# EAGLE board BMS_Slave (EAGLE 7.2.0)
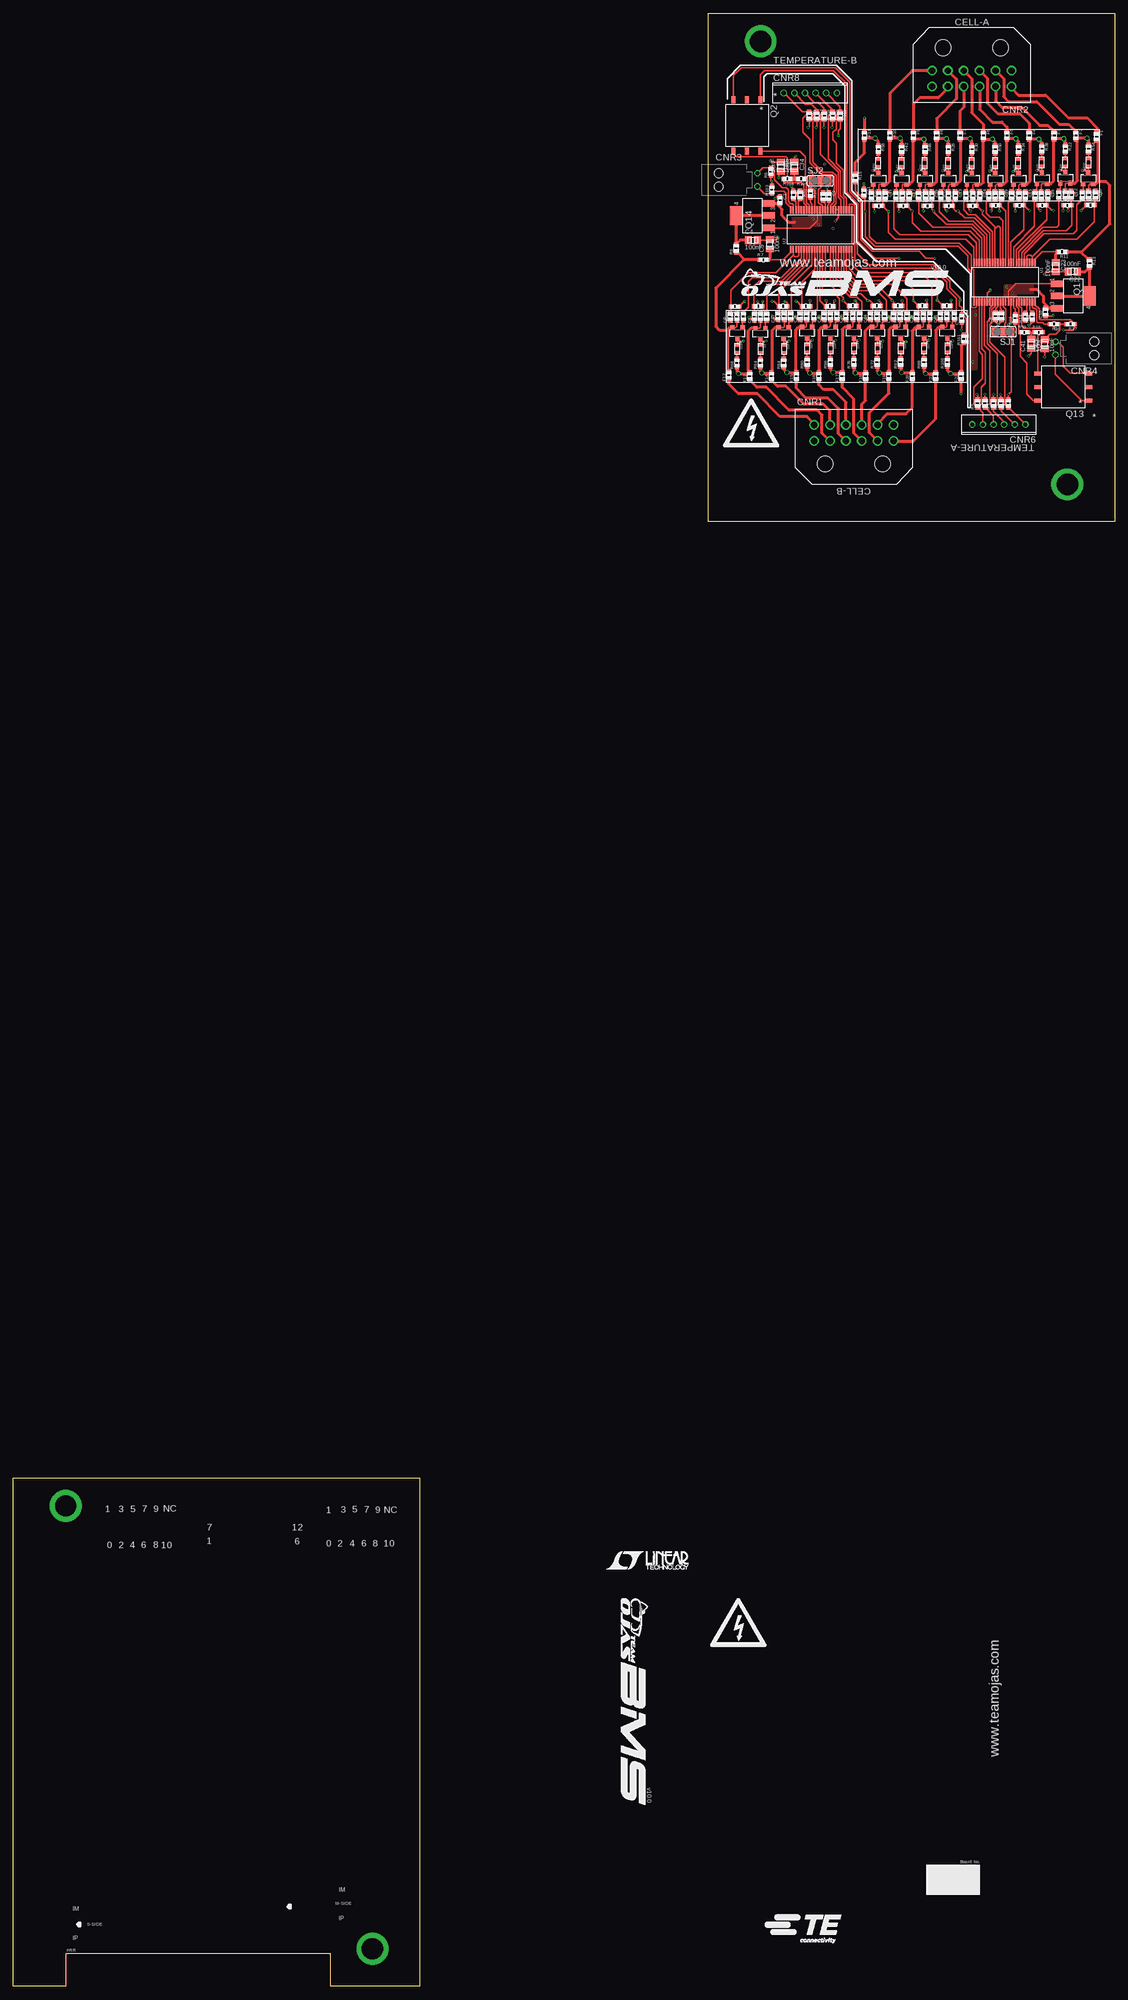
[diagram p5: board, top side]
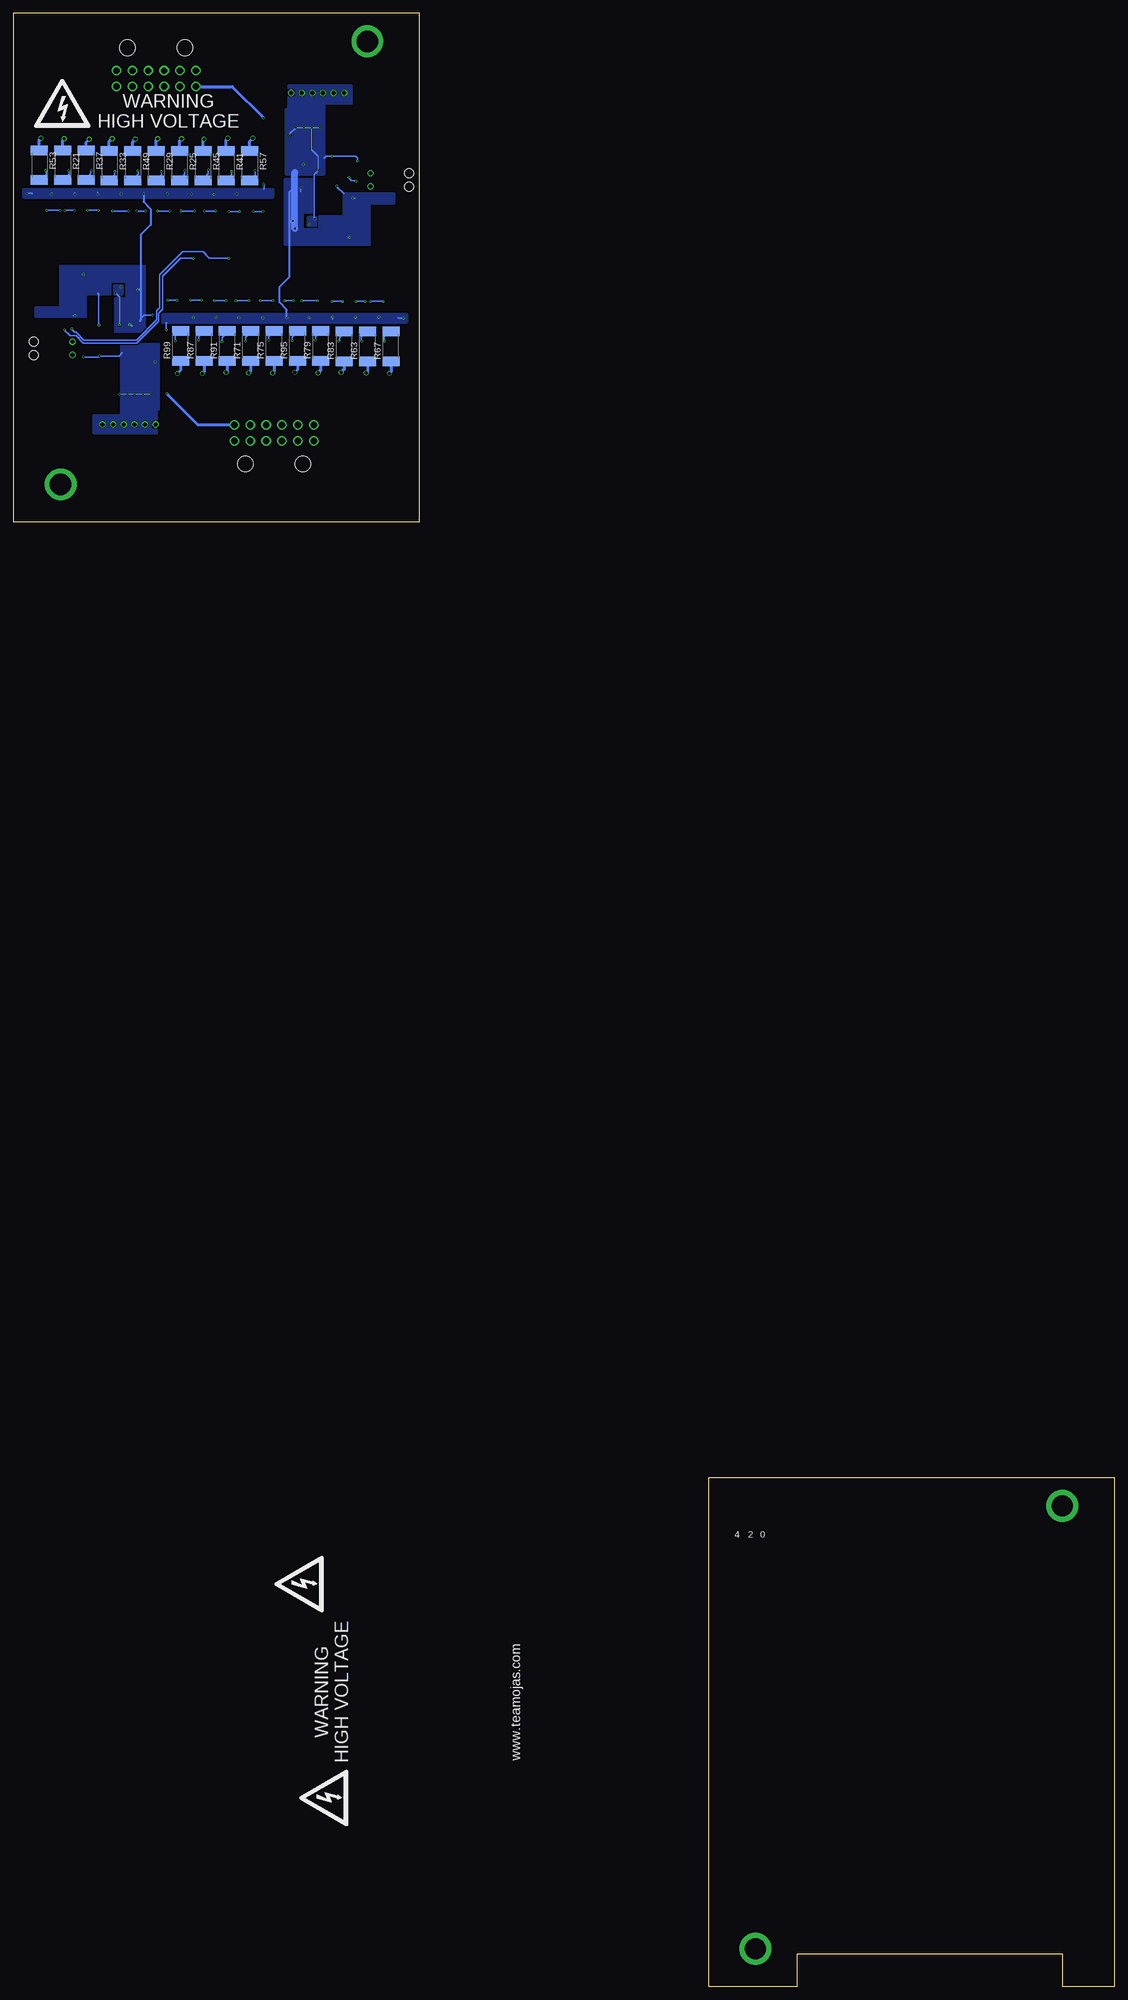
[diagram p6: board, bottom side, seen from below]

Size 207.31 x 371.29 mm. Coordinates in mm from the lower left corner, seen from the top.
Outline: 130.81,371.29 207.31,371.29 207.31,275.59 130.81,275.59 130.81,371.29
Outline: 0,95.7 76.5,95.7 76.5,0 59.7,0 59.7,6.1 9.9,6.1 9.9,0 0,0 0,95.7
Copper layers (1*16): Top 0.035mm / dielectric 1.5mm / Bottom 0.035mm
Design rules "Carnot_syrma": minimum track width 0.1mm, minimum drill 0.2mm, track to track 0.12mm, track to pad 0.12mm, pad to pad 0.12mm, via to via 0.35mm, smd to smd 0.23mm, copper to edge 0.25mm, drill to drill 0.2mm, minimum pad ring 6mil, minimum via ring 4mil, stop-mask expansion 0.05mm, vias tented up to drill 0mil, thermal gap 10mil
tRestrict: 18 lines
bRestrict: 24 lines

## Footprints (pad centres in the part's own frame; a part is rotated, then mirrored left to right if it is on the bottom)
0603 = smd 0.8 x 0.8: P$1 -0.76,0; P$2 0.76,0
0805 = smd 1.3 x 1.5: P$1 -0.85,0; P$2 0.85,0
0430451200 = drill 1.2: 1 7.5,-1.5; 2 4.5,-1.5; 3 1.5,-1.5; 4 -1.5,-1.5; 5 -4.5,-1.5; 6 -7.5,-1.5; 7 7.5,1.5; 8 4.5,1.5; 9 1.5,1.5; 10 -1.5,1.5; 11 -4.5,1.5; 12 -7.5,1.5 | hole 3: -5.4,-5.8; 5.4,-5.8
105313-2202 = drill 0.8 pad 1.2: 1 -1.18,4.98; 2 1.32,4.98 | hole 1.7: -1.18,-2.3; 1.32,-2.3
0532530670 = drill 0.8: 1 -5,0; 2 -3,0; 3 -1,0; 4 1,0; 5 3,0; 6 5,0
LED0603 = smd 0.6 x 0.8: P$1 -0.725,0; P$2 0.725,0
SOT223 = smd 1.219 x 2.235: 1 -2.311,-3.099; 2 0,-3.099; 3 2.311,-3.099 | smd 3.6 x 2.2: 4 0,3.099
HM2101NL = smd 1.3 x 0.76: 1 -4.82,2.54; 2 -4.82,0; 3 -4.82,-2.54; 4 4.82,-2.54; 5 4.82,0; 6 4.82,2.54
SOT23-3 = smd 0.8 x 0.9: 1 -0.95,-1; 2 0.95,-1; 3 0,1.1
2512 = smd 1.8 x 3.2: 1 -2.8,0; 2 2.8,0
SJ_2 = smd 1.168 x 1.6: 1 -1.524,0; 2 0,0; 3 1.524,0
48-LEAD_SSOP = smd 1.4 x 0.3: 1 -3.7,5.8; 2 -3.7,5.3; 3 -3.7,4.8; 4 -3.7,4.3; 5 -3.7,3.8; 6 -3.7,3.3; 7 -3.7,2.8; 8 -3.7,2.3; 9 -3.7,1.8; 10 -3.7,1.3; 11 -3.7,0.8; 12 -3.7,0.3; 13 -3.7,-0.2; 14 -3.7,-0.7; 15 -3.7,-1.2; 16 -3.7,-1.7; 17 -3.7,-2.2; 18 -3.7,-2.7; 19 -3.7,-3.2; 20 -3.7,-3.7; 21 -3.7,-4.2; 22 -3.7,-4.7; 23 -3.7,-5.2; 24 -3.7,-5.7; 25 3.7,-5.7; 26 3.7,-5.2; 27 3.7,-4.7; 28 3.7,-4.2; 29 3.7,-3.7; 30 3.7,-3.2; 31 3.7,-2.7; 32 3.7,-2.2; 33 3.7,-1.7; 34 3.7,-1.2; 35 3.7,-0.7; 36 3.7,-0.2; 37 3.7,0.3; 38 3.7,0.8; 39 3.7,1.3; 40 3.7,1.8; 41 3.7,2.3; 42 3.7,2.8; 43 3.7,3.3; 44 3.7,3.8; 45 3.7,4.3; 46 3.7,4.8; 47 3.7,5.3; 48 3.7,5.8

## Placement (x,y rotation side)
C1  1uF  [0603]  153.52,336.8 270 top
C2  1uF  [0603]  152.42,336.8 270 top
C3  1uF  [0603]  144.32,336.1 270 top
C4  100nF  [0805]  139.21,328.6 0 top
C5  100nF  [0805]  142.42,327.8 90 top
C6  10nF  [0603]  139.52,314.2 90 top
C7  10nF  [0603]  134.92,314.22 90 top
C8  1uF  [0603]  184.91,314.29 90 top
C9  1uF  [0603]  186.01,314.29 90 top
C10  1uF  [0603]  194.31,315.09 90 top
C11  10nF  [0603]  160.09,337.52 270 top
C12  10nF  [0603]  199.11,337.09 270 top
C13  10nF  [0603]  177.31,336.99 270 top
C14  10nF  [0603]  181.91,336.99 270 top
C15  10nF  [0603]  190.51,336.99 270 top
C16  10nF  [0603]  194.71,336.99 270 top
C17  10nF  [0603]  168.61,336.99 270 top
C18  10nF  [0603]  172.91,336.99 270 top
C19  10nF  [0603]  186.01,336.99 270 top
C20  10nF  [0603]  203.71,337.07 270 top
C21  10nF  [0603]  164.11,336.99 270 top
C22  100nF  [0805]  199.42,322.69 180 top
C23  100nF  [0805]  196.21,323.49 270 top
C24  10nF  [0603]  161.32,314.3 90 top
C25  10nF  [0603]  156.72,314.3 90 top
C26  10nF  [0603]  148.12,314.3 90 top
C27  10nF  [0603]  143.92,314.3 90 top
C28  10nF  [0603]  170.02,314.3 90 top
C29  10nF  [0603]  165.72,314.3 90 top
C30  10nF  [0603]  152.62,314.3 90 top
C31  10nF  [0603]  174.52,314.3 90 top
C32  10nF  [0603]  178.54,313.87 90 top
C33  10nF  [0805]  144.47,342.42 270 top
C34  10nF  [0805]  147.01,342.39 270 top
C35  10nF  [0603]  140.22,316.1 180 top
C36  10nF  [0603]  135.85,316.06 180 top
C37  10nF  [0603]  144.92,316.1 180 top
C38  10nF  [0603]  149.22,316.1 180 top
C39  10nF  [0603]  153.72,316.1 180 top
C40  10nF  [0805]  194.16,309.05 90 top
C41  10nF  [0805]  191.61,309.09 90 top
C42  10nF  [0603]  158.02,316.2 180 top
C43  10nF  [0603]  198.41,335.19 0 top
C44  10nF  [0603]  202.78,335.23 0 top
C45  10nF  [0603]  193.71,335.19 0 top
C46  10nF  [0603]  189.41,335.19 0 top
C47  10nF  [0603]  184.91,335.19 0 top
C48  10nF  [0603]  180.61,335.09 0 top
C49  10nF  [0603]  176.11,335.09 0 top
C50  10nF  [0603]  172.11,335.09 0 top
C51  10nF  [0603]  167.51,335.09 0 top
C52  10nF  [0603]  162.91,335.09 0 top
C53  10nF  [0603]  162.52,316.2 180 top
C54  10nF  [0603]  166.52,316.2 180 top
C55  10nF  [0603]  171.12,316.2 180 top
C56  10nF  [0603]  175.72,316.2 180 top
CNR1  [0430451200]  158.22,292.3 0 top
CNR2  [0430451200]  180.41,358.99 180 top
CNR3  COMM-CONNECTOR  [105313-2202]  135.08,340 270 top
CNR4  COMM-CONNECTOR  [105313-2202]  201.14,308.16 90 top
CNR6  MICRO-LATCH  [0532530670]  185.51,293.89 180 top
CNR8  MICRO-LATCH  [0532530670]  150.02,356.3 0 top
D1  LED6X3MM'  [LED0603]  140.62,308.1 270 top
D2  LED6X3MM'  [LED0603]  198.01,343.19 90 top
D3  LED6X3MM'  [LED0603]  176.01,343.09 90 top
D4  LED6X3MM'  [LED0603]  180.41,343.09 90 top
D5  LED6X3MM'  [LED0603]  189.21,343.09 90 top
D6  LED6X3MM'  [LED0603]  193.61,343.19 90 top
D7  LED6X3MM'  [LED0603]  167.21,343.09 90 top
D8  LED6X3MM'  [LED0603]  171.61,343.09 90 top
D9  LED6X3MM'  [LED0603]  184.81,343.09 90 top
D10  LED6X3MM'  [LED0603]  202.41,343.19 90 top
D11  LED6X3MM'  [LED0603]  162.81,343.09 90 top
D12  LED6X3MM'  [LED0603]  136.22,308.1 270 top
D13  LED6X3MM'  [LED0603]  162.62,308.2 270 top
D14  LED6X3MM'  [LED0603]  158.22,308.2 270 top
D15  LED6X3MM'  [LED0603]  149.42,308.2 270 top
D16  LED6X3MM'  [LED0603]  145.02,308.1 270 top
D17  LED6X3MM'  [LED0603]  171.42,308.2 270 top
D18  LED6X3MM'  [LED0603]  167.02,308.2 270 top
D19  LED6X3MM'  [LED0603]  153.82,308.2 270 top
D20  LED6X3MM'  [LED0603]  175.82,308.2 270 top
F1  F0603  [0603]  203.91,348.09 270 top
F2  F0603  [0603]  200.01,348.29 270 top
F3  F0603  [0603]  195.91,348.29 270 top
F4  F0603  [0603]  191.21,348.29 270 top
F5  F0603  [0603]  187.01,348.29 270 top
F6  F0603  [0603]  182.61,348.29 270 top
F7  F0603  [0603]  178.21,348.29 270 top
F8  F0603  [0603]  173.81,348.29 270 top
F9  F0603  [0603]  169.41,348.29 270 top
F10  F0603  [0603]  165.01,348.29 270 top
F11  F0603  [0603]  160.21,348.29 270 top
F12  F0603  [0603]  134.72,303.2 90 top
F13  F0603  [0603]  138.62,303 90 top
F14  F0603  [0603]  142.72,303 90 top
F15  F0603  [0603]  147.42,303 90 top
F16  F0603  [0603]  151.62,303 90 top
F17  F0603  [0603]  156.02,303 90 top
F18  F0603  [0603]  160.42,303 90 top
F19  F0603  [0603]  164.82,303 90 top
F20  F0603  [0603]  169.22,303 90 top
F21  F0603  [0603]  173.62,303 90 top
F22  F0603  [0603]  178.42,303 90 top
Q1  CZT5551  [SOT223]  199.51,318.09 270 top
Q2  HM2101NL  [HM2101NL]  138.11,350.19 270 top
Q3  BSS308PE  [SOT23-3]  198.01,340.29 0 top
Q4  BSS308PE  [SOT23-3]  176.01,340.09 0 top
Q5  BSS308PE  [SOT23-3]  180.41,340.09 0 top
Q6  BSS308PE  [SOT23-3]  189.21,340.09 0 top
Q7  BSS308PE  [SOT23-3]  193.61,340.19 0 top
Q8  BSS308PE  [SOT23-3]  167.21,340.09 0 top
Q9  BSS308PE  [SOT23-3]  171.61,340.09 0 top
Q10  BSS308PE  [SOT23-3]  184.81,340.09 0 top
Q11  BSS308PE  [SOT23-3]  202.31,340.19 0 top
Q12  BSS308PE  [SOT23-3]  162.81,340.09 0 top
Q13  HM2101NL  [HM2101NL]  197.64,300.94 180 top
Q14  CZT5551  [SOT223]  139.12,333.2 90 top
Q15  BSS308PE  [SOT23-3]  140.62,311 180 top
Q16  BSS308PE  [SOT23-3]  136.32,311.1 180 top
Q17  BSS308PE  [SOT23-3]  162.62,311.2 180 top
Q18  BSS308PE  [SOT23-3]  158.22,311.2 180 top
Q19  BSS308PE  [SOT23-3]  149.42,311.2 180 top
Q20  BSS308PE  [SOT23-3]  145.02,311.1 180 top
Q21  BSS308PE  [SOT23-3]  171.42,311.2 180 top
Q22  BSS308PE  [SOT23-3]  167.02,311.2 180 top
Q23  BSS308PE  [SOT23-3]  153.82,311.2 180 top
Q24  BSS308PE  [SOT23-3]  175.82,311.2 180 top
R1  100R  [0603]  187.31,297.89 90 top
R2  100R  [0603]  185.91,297.89 90 top
R3  100R  [0603]  184.51,297.89 90 top
R4  100R  [0603]  182.91,297.89 90 top
R5  100R  [0603]  181.51,297.89 90 top
R6  51R  [0603]  142.6,341.48 90 top
R7  100R  [0603]  141.22,324.9 0 top
R8  1.2k  [0603]  146.82,337.1 270 top
R9  100R  [0603]  136.07,327.05 90 top
R10  51R  [0603]  195.91,312.79 180 top
R11  100R  [0603]  197.41,326.39 180 top
R12  1.2k  [0603]  191.81,314.19 90 top
R13  100R  [0603]  202.56,324.24 270 top
R14  806R  [0603]  190.51,314.19 90 top
R15  100R  [0603]  158.51,340.29 270 top
R16  1M  [0603]  188.61,313.89 90 top
R17  51R  [0603]  199.01,312.79 180 top
R18  51R  [0603]  193.01,311.29 0 top
R19  100R  [0603]  198.01,337.09 270 top
R20  3.3k  [0603]  196.81,337.09 270 top
R21  33R  [2512]  198.01,342.69 270 bottom
R22  475R  [0603]  198.01,345.79 270 top
R23  100R  [0603]  176.01,336.99 270 top
R24  3.3k  [0603]  174.61,336.99 270 top
R25  33R  [2512]  176.01,342.59 270 bottom
R26  475R  [0603]  176.01,345.69 270 top
R27  100R  [0603]  180.61,336.99 270 top
R28  3.3k  [0603]  179.31,336.99 270 top
R29  33R  [2512]  180.41,342.59 270 bottom
R30  475R  [0603]  180.41,345.69 270 top
R31  100R  [0603]  189.31,336.99 270 top
R32  3.3k  [0603]  187.91,336.99 270 top
R33  33R  [2512]  189.21,342.59 270 bottom
R34  475R  [0603]  189.21,345.69 270 top
R35  100R  [0603]  193.51,336.99 270 top
R36  3.3k  [0603]  192.31,336.99 270 top
R37  33R  [2512]  193.61,342.69 270 bottom
R38  475R  [0603]  193.61,345.79 270 top
R39  100R  [0603]  167.31,336.99 270 top
R40  3.3k  [0603]  166.11,336.99 270 top
R41  33R  [2512]  167.21,342.59 270 bottom
R42  475R  [0603]  167.21,345.69 270 top
R43  100R  [0603]  171.71,336.99 270 top
R44  3.3k  [0603]  170.41,336.99 270 top
R45  33R  [2512]  171.61,342.59 270 bottom
R46  475R  [0603]  171.61,345.69 270 top
R47  100R  [0603]  184.81,336.99 270 top
R48  3.3k  [0603]  183.61,336.99 270 top
R49  33R  [2512]  184.81,342.59 270 bottom
R50  475R  [0603]  184.81,345.69 270 top
R51  100R  [0603]  202.41,337.09 270 top
R52  3.3k  [0603]  201.22,337.05 270 top
R53  33R  [2512]  202.41,342.69 270 bottom
R54  475R  [0603]  202.41,345.79 270 top
R55  100R  [0603]  162.91,336.99 270 top
R56  3.3k  [0603]  161.51,336.99 270 top
R57  33R  [2512]  162.81,342.59 270 bottom
R58  475R  [0603]  162.81,345.69 270 top
R59  51R  [0603]  190.31,311.29 0 top
R60  806R  [0603]  148.12,337.1 270 top
R61  100R  [0603]  140.62,314.2 90 top
R62  3.3k  [0603]  141.82,314.2 90 top
R63  33R  [2512]  140.62,308.6 90 bottom
R64  475R  [0603]  140.62,305.5 90 top
R65  100R  [0603]  136.22,314.2 90 top
R66  3.3k  [0603]  137.41,314.24 90 top
R67  33R  [2512]  136.22,308.6 90 bottom
R68  475R  [0603]  136.22,305.5 90 top
R69  100R  [0603]  162.62,314.3 90 top
R70  3.3k  [0603]  164.02,314.3 90 top
R71  33R  [2512]  162.62,308.7 90 bottom
R72  475R  [0603]  162.62,305.6 90 top
R73  100R  [0603]  158.02,314.3 90 top
R74  3.3k  [0603]  159.32,314.3 90 top
R75  33R  [2512]  158.22,308.7 90 bottom
R76  475R  [0603]  158.22,305.6 90 top
R77  100R  [0603]  149.32,314.3 90 top
R78  3.3k  [0603]  150.72,314.3 90 top
R79  33R  [2512]  149.42,308.7 90 bottom
R80  475R  [0603]  149.42,305.6 90 top
R81  100R  [0603]  145.12,314.3 90 top
R82  3.3k  [0603]  146.32,314.3 90 top
R83  33R  [2512]  145.02,308.6 90 bottom
R84  475R  [0603]  145.02,305.5 90 top
R85  100R  [0603]  171.32,314.3 90 top
R86  3.3k  [0603]  172.52,314.3 90 top
R87  33R  [2512]  171.42,308.7 90 bottom
R88  475R  [0603]  171.42,305.6 90 top
R89  100R  [0603]  166.92,314.3 90 top
R90  3.3k  [0603]  168.22,314.3 90 top
R91  33R  [2512]  167.02,308.7 90 bottom
R92  475R  [0603]  167.02,305.6 90 top
R93  100R  [0603]  153.82,314.3 90 top
R94  3.3k  [0603]  155.02,314.3 90 top
R95  33R  [2512]  153.82,308.7 90 bottom
R96  475R  [0603]  153.82,305.6 90 top
R97  100R  [0603]  175.72,314.3 90 top
R98  3.3k  [0603]  177.12,314.3 90 top
R99  33R  [2512]  175.82,308.7 90 bottom
R100  475R  [0603]  175.82,305.6 90 top
R101  100R  [0603]  178.92,310 90 top
R102  1M  [0603]  150.02,337.4 270 top
R103  51R  [0603]  142.8,338.08 90 top
R104  51R  [0603]  145.71,340.09 180 top
R105  51R  [0603]  148.31,340.09 180 top
R106  100R  [0603]  149.82,352 270 top
R107  100R  [0603]  151.22,352 270 top
R108  100R  [0603]  152.62,352 270 top
R109  100R  [0603]  154.22,352 270 top
R110  100R  [0603]  155.62,352 270 top
SJ1  [SJ_2]  186.32,311.37 180 top
SJ2  [SJ_2]  151.91,339.79 0 top
U1  LTC6804  [48-LEAD_SSOP]  186.51,320.69 270 top
U2  LTC6804  [48-LEAD_SSOP]  152.12,330.6 90 top

## Tracks (layer width: path | path; a pad name or v marks a point on that pad's centre or on a via)
5_VREG-A  (via drill 0.25)
  Top 0.254: 188.31,317.02 U1.40 188.29,316.97 188.29,315.91 188.61,315.59 R16.P$2 | R5.P$2 181.51,299.49 v181.41,299.59 | R1.P$2 v187.31,299.59 187.85,300.13 SJ1.1 187.85,312.15 v187.31,312.69 | R4.P$2 v182.91,299.59 | R3.P$2 v184.51,299.59 | R2.P$2 185.91,299.49 v185.81,299.59
  Top 0.61: Q1.3 195.04,315.78 | 191.51,319.29 192.71,319.29 193.91,318.09 193.91,316.91 195.04,315.78 | 195.04,315.78 194.38,315.78 C10.P$2
  Bottom 0.254: v181.41,299.59 v182.91,299.59 v184.51,299.59 v185.81,299.59 v187.31,299.59 | v187.31,312.69 187.31,317.89 v188.11,318.69
  other vias: 187.01,319.79
  pour Top: 186.51,317.19 188.81,317.19 188.81,318.49 192.01,318.49 192.01,320.09 186.51,320.09
  pour Bottom: 186.71,318.29 188.41,318.29 188.41,320.09 186.71,320.09
5_VREG-B  (via drill 0.25)
  Top 0.254: 150.32,334.27 U2.40 150.34,334.32 150.34,335.38 150.02,335.7 R102.P$2 | R106.P$2 149.82,350 v149.61,349.79 | R110.P$2 155.71,351.15 155.71,349.59 155.31,349.19 v155.31,348.29 | R107.P$2 151.22,349.9 v151.11,349.79 | R108.P$2 v152.62,349.8 v152.61,349.79 | R109.P$2 154.22,349.9 v154.11,349.79 | v149.91,341.69 150.48,341.12 150.48,339.88 SJ2.1
  Top 0.61: Q14.3 143.59,335.51 | 147.12,332 145.92,332 144.72,333.2 144.72,334.38 143.59,335.51 | 143.59,335.51 144.15,335.51 C3.P$2
  Bottom 0.254: v149.61,349.79 v151.11,349.79 | v151.11,349.79 v152.61,349.79 v154.11,349.79 155.31,348.59 v155.31,348.29 | v151.11,349.79 151.11,345.59 149.91,344.39 v149.91,341.69 150.71,340.89 150.71,332.79 v150.52,332.6
  other vias: 151.62,331.6
  pour Top: 152.12,334.1 149.82,334.1 149.82,332.8 146.62,332.8 146.62,331.2 152.12,331.2
  pour Bottom: 151.92,333 150.22,333 150.22,331.2 151.92,331.2
AFT0  (via drill 0.6)
  Top 0.61: R58.P$1 162.81,347.19 v162.21,347.79 160.47,347.79 F11.P$2 160.21,344.99 158.51,343.29 R15.P$1
  Bottom 0.61: R57.1 162.81,347.19 v162.21,347.79
AFT1  (via drill 0.6)
  Top 0.254: R55.P$1 162.91,338.89 163.11,339.09 Q12.2
  Top 0.61: Q12.2 164.41,339.09 165.01,339.69 F10.P$2 165.27,347.79 v166.91,347.79 167.21,347.49 R42.P$1
  Bottom 0.61: R41.1 167.21,347.49 v166.91,347.79
AFT2  (via drill 0.6)
  Top 0.254: R39.P$1 167.31,338.89 167.51,339.09 Q8.2
  Top 0.61: Q8.2 168.71,339.09 169.41,339.79 F9.P$2 169.47,347.59 v171.41,347.59 171.61,347.39 R46.P$1
  Bottom 0.61: R45.1 171.61,347.39 v171.41,347.59
AFT3  (via drill 0.6)
  Top 0.254: R43.P$1 171.71,338.89 171.91,339.09 Q9.2
  Top 0.61: Q9.2 173.31,339.09 173.81,339.59 F8.P$2 173.97,347.69 v175.61,347.69 176.01,347.29 R26.P$1
  Bottom 0.61: R25.1 176.01,347.29 v175.61,347.69
AFT4  (via drill 0.6)
  Top 0.254: R23.P$1 176.01,338.79 176.31,339.09 Q4.2
  Top 0.61: Q4.2 177.61,339.09 178.31,339.79 178.31,347.43 F7.P$2 178.37,347.69 v180.11,347.69 180.41,347.39 R30.P$1
  Bottom 0.61: R29.1 180.41,347.39 v180.11,347.69
AFT5  (via drill 0.6)
  Top 0.254: R27.P$1 180.61,338.89 180.81,339.09 Q5.2
  Top 0.61: Q5.2 182.21,339.09 182.61,339.49 F6.P$2 182.65,347.49 182.75,347.59 v184.31,347.59 184.81,347.09 R50.P$1
  Bottom 0.61: R49.1 184.81,347.09 v184.31,347.59
AFT6  (via drill 0.6)
  Top 0.254: R47.P$1 184.81,338.79 185.11,339.09 Q10.2
  Top 0.61: Q10.2 186.41,339.09 187.01,339.69 F5.P$2 187.17,347.69 v188.71,347.69 189.21,347.19 R34.P$1
  Bottom 0.61: R33.1 189.21,347.19 v188.71,347.69
AFT7  (via drill 0.6)
  Top 0.254: R31.P$1 189.31,338.89 189.51,339.09 Q6.2
  Top 0.61: Q6.2 190.81,339.09 191.41,339.69 191.41,347.33 F4.P$2 191.27,347.59 v193.01,347.59 193.61,346.99 R38.P$1
  Bottom 0.61: R37.1 193.61,346.99 v193.01,347.59
AFT8  (via drill 0.6)
  Top 0.254: R35.P$1 193.51,338.99 193.71,339.19 Q7.2
  Top 0.61: Q7.2 195.31,339.19 195.81,339.69 195.81,347.43 F3.P$2 196.07,347.69 v197.71,347.69 198.01,347.39 R22.P$1
  Bottom 0.61: R21.1 198.01,347.39 v197.71,347.69
AFT9  (via drill 0.6)
  Top 0.254: R19.P$1 198.01,339.09 198.21,339.29 Q3.2
  Top 0.61: Q3.2 199.81,339.29 200.31,339.79 200.31,347.23 F2.P$2 200.27,347.79 v202.11,347.79 202.41,347.49 R54.P$1
  Bottom 0.61: R53.1 202.41,347.49 v202.11,347.79
AFT10-A
  Top 0.254: R51.P$1 202.41,338.89 202.71,339.19 Q11.2
  Top 0.61: Q11.2 203.81,339.19 204.21,339.59 | 204.21,339.59 204.21,347.03 F1.P$2 | R11.P$1 201.01,326.39 | 201.01,326.39 201.11,326.39 206.41,331.69 206.41,338.89 205.71,339.59 204.21,339.59 | 201.01,326.39 200.96,326.34 202.31,325 R13.P$1
AFT10-B  (via drill 0.6)
  Top 0.61: R100.P$1 175.82,304.1 v176.42,303.5 178.16,303.5 F22.P$2 178.42,308.74 R101.P$1
  Bottom 0.61: R99.1 175.82,304.1 v176.42,303.5
AFT11  (via drill 0.6)
  Top 0.254: R97.P$1 175.72,312.4 175.52,312.2 Q24.2
  Top 0.61: Q24.2 174.22,312.2 173.62,311.6 F21.P$2 173.36,303.5 v171.72,303.5 171.42,303.8 R88.P$1
  Bottom 0.61: R87.1 171.42,303.8 v171.72,303.5
AFT12  (via drill 0.6)
  Top 0.254: R85.P$1 171.32,312.4 171.12,312.2 Q21.2
  Top 0.61: Q21.2 169.92,312.2 169.22,311.5 F20.P$2 169.16,303.7 v167.22,303.7 167.02,303.9 R92.P$1
  Bottom 0.61: R91.1 167.02,303.9 v167.22,303.7
AFT13  (via drill 0.6)
  Top 0.254: R89.P$1 166.92,312.4 166.72,312.2 Q22.2
  Top 0.61: Q22.2 165.32,312.2 164.82,311.7 F19.P$2 164.66,303.6 v163.02,303.6 162.62,304 R72.P$1
  Bottom 0.61: R71.1 162.62,304 v163.02,303.6
AFT14  (via drill 0.6)
  Top 0.254: R69.P$1 162.62,312.5 162.32,312.2 Q17.2
  Top 0.61: Q17.2 161.02,312.2 160.32,311.5 160.32,303.86 F18.P$2 160.26,303.6 v158.52,303.6 158.22,303.9 R76.P$1
  Bottom 0.61: R75.1 158.22,303.9 v158.52,303.6
AFT15  (via drill 0.6)
  Top 0.254: R73.P$1 158.02,312.4 157.82,312.2 Q18.2
  Top 0.61: Q18.2 156.42,312.2 156.02,311.8 F17.P$2 155.98,303.8 155.88,303.7 v154.32,303.7 153.82,304.2 R96.P$1
  Bottom 0.61: R95.1 153.82,304.2 v154.32,303.7
AFT16  (via drill 0.6)
  Top 0.254: R93.P$1 153.82,312.5 153.52,312.2 Q23.2
  Top 0.61: Q23.2 152.22,312.2 151.62,311.6 F16.P$2 151.46,303.6 v149.92,303.6 149.42,304.1 R80.P$1
  Bottom 0.61: R79.1 149.42,304.1 v149.92,303.6
AFT17  (via drill 0.6)
  Top 0.254: R77.P$1 149.32,312.4 149.12,312.2 Q19.2
  Top 0.61: Q19.2 147.82,312.2 147.22,311.6 147.22,303.96 F15.P$2 147.36,303.7 v145.62,303.7 145.02,304.3 R84.P$1
  Bottom 0.61: R83.1 145.02,304.3 v145.62,303.7
AFT18  (via drill 0.6)
  Top 0.254: R81.P$1 145.12,312.3 144.92,312.1 Q20.2
  Top 0.61: Q20.2 143.32,312.1 142.82,311.6 142.82,303.86 F14.P$2 142.56,303.6 v140.92,303.6 140.62,303.9 R64.P$1
  Bottom 0.61: R63.1 140.62,303.9 v140.92,303.6
AFT19  (via drill 0.6)
  Top 0.254: R61.P$1 140.62,312.2 140.42,312 Q15.2
  Top 0.61: Q15.2 138.82,312 138.32,311.5 138.32,304.06 F13.P$2 138.36,303.5 v136.52,303.5 136.22,303.8 R68.P$1
  Bottom 0.61: R67.1 136.22,303.8 v136.52,303.5
AFT20
  Top 0.254: R65.P$1 136.22,312.4 135.92,312.1 Q16.2
  Top 0.61: Q16.2 134.82,312.1 134.42,311.7 | 134.42,311.7 134.42,304.26 F12.P$2 | R7.P$1 137.62,324.9 | 137.62,324.9 137.52,324.9 132.22,319.6 132.22,312.4 132.92,311.7 134.42,311.7 | 137.62,324.9 137.67,324.95 136.32,326.29 R9.P$1
CELL1
  Top 0.61: CNR2.1 169.21,360.49 165.01,356.29 F10.P$1
CELL2
  Top 0.61: CNR2.8 175.91,357.19 174.11,355.39 170.61,355.39 169.41,354.19 F9.P$1
CELL3
  Top 0.61: CNR2.2 177.51,358.89 177.51,355.19 173.81,351.49 F8.P$1
CELL4
  Top 0.61: CNR2.9 178.91,353.59 178.21,352.89 F7.P$1
CELL5
  Top 0.61: CNR2.3 180.41,358.99 180.41,352.59 182.61,350.39 F6.P$1
CELL6
  Top 0.61: CNR2.10 181.91,353.19 184.31,350.79 186.11,350.79 187.01,349.89 F5.P$1
CELL7
  Top 0.61: CNR2.4 183.31,359.09 183.31,354.39 185.31,352.39 189.41,352.39 191.21,350.59 F4.P$1
CELL8
  Top 0.61: CNR2.11 184.91,354.79 186.11,353.59 189.81,353.59 193.21,350.19 194.77,350.19 F3.P$1
CELL9
  Top 0.61: CNR2.5 186.41,358.99 186.41,355.59 187.31,354.69 192.61,354.69 196.91,350.39 198.67,350.39 F2.P$1
CELL10
  Top 0.61: CNR2.12 187.91,357.19 189.21,355.89 194.31,355.89 198.61,351.59 202.11,351.59 203.91,349.79 F1.P$1
CELL11
  Top 0.61: CNR1.1 169.42,290.8 173.62,295 F21.P$1
CELL12
  Top 0.61: CNR1.8 162.72,294.1 164.52,295.9 168.02,295.9 169.22,297.1 F20.P$1
CELL13
  Top 0.61: CNR1.2 161.12,292.4 161.12,296.1 164.82,299.8 F19.P$1
CELL14
  Top 0.61: CNR1.9 159.72,297.7 160.42,298.4 F18.P$1
CELL15
  Top 0.61: CNR1.3 158.22,292.3 158.22,298.7 156.02,300.9 F17.P$1
CELL16
  Top 0.61: CNR1.10 156.72,298.1 154.32,300.5 152.52,300.5 151.62,301.4 F16.P$1
CELL17
  Top 0.61: CNR1.4 155.32,292.2 155.32,296.9 153.32,298.9 149.22,298.9 147.42,300.7 F15.P$1
CELL18
  Top 0.61: CNR1.11 153.72,296.5 152.52,297.7 148.82,297.7 145.42,301.1 143.86,301.1 F14.P$1
CELL19
  Top 0.61: CNR1.5 152.22,292.3 152.22,295.7 151.32,296.6 146.02,296.6 141.72,300.9 139.96,300.9 F13.P$1
CELL20
  Top 0.61: CNR1.12 150.72,294.1 149.42,295.4 144.32,295.4 140.02,299.7 136.52,299.7 134.72,301.5 F12.P$1
CELL-GND-A  (via drill 0.25)
  Top 0.61: v160.21,351.59 F11.P$1
  Bottom 0.61: CNR2.7 166.11,357.49 v160.21,351.59
CELL-GND-B  (via drill 0.25)
  Top 0.61: v178.42,299.7 F22.P$1
  Bottom 0.61: CNR1.7 172.52,293.8 v178.42,299.7
GNDA  (via drill 0.25)
  Top 0.254: C21.P$1 164.75,337.75 v165.21,337.29 | C17.P$1 168.95,337.75 v169.51,337.19 | C18.P$1 173.35,337.75 v173.81,337.29 | C13.P$1 177.85,337.75 v178.31,337.29 | C14.P$1 182.35,337.75 v182.81,337.29 | C19.P$1 186.55,337.75 v187.01,337.29 | C15.P$1 190.85,337.75 v191.41,337.19 | C16.P$1 195.15,337.75 v195.71,337.19 | C12.P$1 199.45,337.85 v200.11,337.19 | C20.P$1 204.26,337.83 v204.71,337.39 | U1.31 U1.30 183.31,318.59 v183.91,319.19 | C11.P$1 160.09,338.87 160.11,338.89 v160.11,339.19 | v194.11,322.19 194.56,322.64 C23.P$2 196.26,322.69 C22.P$2 | C8.P$1 184.91,313.19 v185.41,312.69 | SJ1.3 184.8,312.08 v185.41,312.69 | C9.P$1 186.01,313.29 v185.41,312.69 | C10.P$1 195.65,314.33 v195.71,314.39 | R12.P$1 191.81,313.19 v191.21,312.59 | C41.P$1 191.61,307.29 v191.11,306.79 | C40.P$1 194.16,306.64 v194.11,306.59
  Bottom 0.254: v165.21,337.29 165.21,337.19 | v169.51,337.19 169.51,337.29 | v173.81,337.29 173.71,337.39 | v178.31,337.29 178.31,337.49 | v182.81,337.29 182.81,337.49 | v187.01,337.29 187.01,337.49 | v191.41,337.19 191.41,337.59 | v195.71,337.19 195.71,337.49 | v200.11,337.19 200.11,337.49 | v204.71,337.39 203.81,337.39 203.71,337.29 | v160.11,339.19 160.11,338.29 160.21,338.19 | v185.41,312.69 185.21,312.69 184.91,312.39 | v195.71,314.39 196.01,314.39 | v191.21,312.59 191.21,318.39 191.41,318.59 | v181.11,314.49 182.71,314.49 183.31,313.89 | v183.91,319.19 183.71,319.19 183.31,319.59 | 186.81,307.39 187.41,306.79 v191.11,306.79 191.31,306.59 v194.11,306.59
  Bottom 0.406: v182.81,337.29 182.81,335.79 181.41,334.39 181.41,331.49 183.31,329.59 183.31,319.59 183.31,313.89 183.31,313.59 183.51,313.39
  other vias: 180.61,305.69
  pour Bottom: 158.51,336.59 205.31,336.59 205.31,338.19 158.51,338.19
  pour Bottom: 198.61,323.79 182.51,323.79 182.51,311.29 188.21,311.29 188.21,317.69 186.01,317.69 186.01,320.69 189.01,320.69 189.01,318.29 193.61,318.29 193.61,314.09 203.21,314.09 203.21,315.99 198.61,315.99
  pour Bottom: 180.21,293.39 180.21,296.69 179.81,296.69 179.81,309.09 187.11,309.09 187.11,295.69 192.31,295.69 192.31,292.19 180.21,292.19
  pour Top: 179.91,304.19 179.91,315.39 181.41,315.39 181.41,304.19
GNDB  (via drill 0.25)
  Top 0.254: C31.P$1 173.88,313.54 v173.42,314 | C28.P$1 169.68,313.54 v169.12,314.1 | C29.P$1 165.28,313.54 v164.82,314 | C24.P$1 160.78,313.54 v160.32,314 | C25.P$1 156.28,313.54 v155.82,314 | C30.P$1 152.08,313.54 v151.62,314 | C26.P$1 147.78,313.54 v147.22,314.1 | C27.P$1 143.48,313.54 v142.92,314.1 | C6.P$1 139.18,313.44 v138.52,314.1 | C7.P$1 134.37,313.45 v133.92,313.9 | U2.31 U2.30 155.32,332.8 v154.71,332.19 | C32.P$1 178.54,311.72 v178.52,311.7 | C3.P$1 143.78,336.86 v143.41,336.49 | C4.P$2 142.37,328.6 C5.P$2 143.57,328.65 v144.01,329.09 | C34.P$1 147.01,344.09 v147.31,344.39 | C33.P$1 142.73,343.27 v142.51,343.49 | R8.P$1 146.82,338.28 146.41,338.69 v146.41,338.79 | C2.P$1 153.01,337.56 | 153.01,337.56 C1.P$1 | 153.01,337.56 153.21,337.76 v153.21,338.49 153.21,339.57 SJ2.3
  Bottom 0.254: v173.42,314 173.42,314.1 | v169.12,314.1 169.12,314 | v164.82,314 164.92,313.9 | v160.32,314 160.32,313.8 | v155.82,314 155.82,313.8 | v151.62,314 151.62,313.8 | v147.22,314.1 147.22,313.7 | v142.92,314.1 142.92,313.8 | v138.52,314.1 138.52,313.8 | v133.92,313.9 134.82,313.9 134.92,314 | v178.52,311.7 178.52,313 178.42,313.1 | v143.41,336.49 143.01,336.49 | v144.01,329.09 144.31,329.09 | 148.81,343.99 148.41,344.39 v147.31,344.39 142.91,344.39 142.51,343.99 v142.51,343.49 | 145.01,337.29 146.41,338.69 v146.41,338.79 | v153.21,338.49 153.21,337.76 | v154.71,332.19 155.02,332.19 155.32,331.89
  Bottom 0.406: v155.82,314 155.82,315.5 157.22,316.9 157.22,319.8 155.32,321.7 155.32,331.89 155.32,337.7 155.12,337.9
  Bottom 1.27: v154.31,330.79 154.31,341.29
  other vias: 152.71,342.89
  pour Bottom: 180.12,314.7 133.32,314.7 133.32,313.1 180.12,313.1
  pour Bottom: 140.11,327.69 156.21,327.69 156.21,340.19 150.51,340.19 150.51,333.79 152.71,333.79 152.71,330.79 149.71,330.79 149.71,333.19 145.11,333.19 145.11,337.39 135.51,337.39 135.51,335.49 140.11,335.49
  pour Bottom: 155.61,356.59 155.61,353.29 156.01,353.29 156.01,340.89 148.71,340.89 148.71,354.29 143.51,354.29 143.51,357.79 155.61,357.79
IBIAS-A
  Top 0.254: U1.45 190.81,315.25 R14.P$2
IBIAS-B
  Top 0.254: U2.45 147.82,336.04 R60.P$2
ICMP-A
  Top 0.254: R14.P$1 190.75,313.43 191.11,313.79 191.11,314.25 R12.P$2 191.31,315.45 U1.46
ICMP-B
  Top 0.254: R60.P$1 147.88,337.86 147.52,337.5 147.52,337.04 R8.P$2 147.32,335.84 U2.46
IM-MASTER
  Top 0.254: CNR4.1 196.16,303.34 201.11,298.39 Q13.1
IMA-A
  Top 0.254: U1.41 188.81,316.19 189.31,315.69 189.31,311.53 R59.P$1 189.55,306.75 190.81,305.49 190.81,299.59 192.01,298.39 Q13.6
IMA-B
  Top 0.254: U2.41 149.82,335.18 149.31,335.69 149.31,339.65 149.07,339.89 R105.P$1 149.07,339.97 149.11,339.93 149.11,344.29 148.03,345.37 Q2.6
IMB-A  (via drill 0.25)
  Top 0.254: U1.47 191.81,315.99 192.01,315.79 192.31,315.79 192.61,315.49 192.61,313.29 192.81,313.09 193.81,313.09 194.11,312.79 R10.P$2 195.41,312.79 v196.31,311.89 | Q2.1 140.65,359.73 141.41,360.49 154.41,360.49 156.91,357.99 156.91,337.59 159.01,335.49 159.01,328.39 162.21,325.19 v166.71,325.19
  Bottom 0.254: v166.71,325.19 170.41,325.19 171.61,326.39 175.41,326.39 179.71,322.09 179.71,315.89 180.31,315.29 180.31,313.59 184.11,309.79 194.01,309.79 195.51,311.29 195.71,311.29 v196.31,311.89
IMB-B
  Top 0.254: U2.47 146.82,335.28 146.61,335.49 146.31,335.49 145.91,335.89 145.91,338.09 145.51,338.49 144.81,338.49 143.31,339.99 143.31,341.89 142.96,342.24 R6.P$2 141.12,342.24 CNR3.1
IP-MASTER
  Top 0.254: CNR4.2 196.62,309.48 197.61,308.49 197.61,304.89 198.91,303.59 202.34,303.59 Q13.3
IPA-A
  Top 0.254: U1.42 189.31,316.29 189.81,315.79 189.81,312.49 190.31,311.99 193.61,311.99 193.71,311.89 193.71,311.39 | 193.71,311.39 192.81,310.49 Q13.4 | 193.71,311.39 193.71,311.35 R18.P$2
IPA-B
  Top 0.254: U2.42 149.32,335.08 148.81,335.59 148.81,338.89 148.31,339.39 145.01,339.39 145.01,339.73 144.95,339.79 R104.P$2 144.95,339.95 145.01,339.89 145.71,340.59 145.71,343.99 145.41,344.29 136.07,344.29 135.57,344.79 | 135.57,344.73 135.57,344.79 | 135.57,344.79 Q2.4
IPB-A  (via drill 0.25)
  Top 0.254: U1.48 192.41,316.89 192.41,316.39 193.11,315.69 193.11,313.79 193.31,313.59 198.97,313.59 R17.P$1 199.81,312.75 199.81,312.09 199.41,311.69 v197.71,311.69 | Q2.3 135.57,359.65 137.01,361.09 154.71,361.09 157.51,358.29 157.51,337.69 159.51,335.69 159.51,328.69 161.71,326.49 170.51,326.49 171.81,325.19 v173.41,325.19
  Bottom 0.254: v173.41,325.19 175.81,325.19 179.21,321.79 179.21,315.59 179.91,314.89 179.91,313.39 184.11,309.19 194.11,309.19 195.51,310.59 196.61,310.59 v197.71,311.69
IPB-B
  Top 0.254: CNR3.2 141.43,337.32 R103.P$1 143.27,337.79 145.01,337.79 145.41,337.39 145.41,335.69 146.32,334.78 U2.48
M0-A  (via drill 0.25)
  Top 0.254: C52.P$1 162.11,335.05 v162.11,333.99 | U1.26 181.29,316.97 181.29,316.07 181.11,315.89 180.51,315.89 180.31,316.09 180.31,322.69 179.71,323.29 179.71,325.69 177.91,327.49 162.21,327.49 160.41,329.29 160.41,333.89 v160.31,333.99 160.31,336.29 | R15.P$2 158.51,337.83 159.79,336.56 160.04,336.56 | 160.31,336.29 160.31,336.33 | 160.04,336.56 160.31,336.29 | C11.P$2 160.09,336.6 160.04,336.56
  Bottom 0.254: v162.11,333.99 v160.31,333.99
M0-B  (via drill 0.25)
  Top 0.254: C56.P$1 176.52,316.24 v176.52,317.3 | U2.26 157.34,334.32 157.34,335.22 157.51,335.39 158.11,335.39 158.31,335.19 158.31,328.29 158.91,327.69 158.91,326.09 161.01,323.99 173.21,323.99 176.31,320.89 176.31,319.69 178.21,317.79 v178.21,317.31 v178.22,317.3 178.11,317.19 178.11,316.29 178.54,315.86 C32.P$2 178.57,314.63 179.41,313.79 179.41,311.25 R101.P$2
  Bottom 0.254: v176.52,317.3 v178.22,317.3
M1-A  (via drill 0.25)
  Top 0.254: R55.P$2 C21.P$2 163.67,335.79 C52.P$2 | 163.61,335.03 C52.P$2 | C51.P$1 166.71,335.05 v166.71,333.99 | C52.P$2 163.67,335.03 v164.71,333.99 164.71,330.09 166.01,328.79 179.31,328.79 180.79,327.31 180.79,324.41 U1.24
  Bottom 0.254: v166.71,333.99 v164.71,333.99
M1-B  (via drill 0.25)
  Top 0.254: R97.P$2 C31.P$2 174.96,315.5 C56.P$2 | 175.02,316.26 C56.P$2 | C55.P$1 171.92,316.24 v171.92,317.3 | C56.P$2 174.96,316.26 v173.92,317.3 173.92,321.2 172.62,322.5 159.32,322.5 157.84,323.98 157.84,326.88 U2.24
  Bottom 0.254: v171.92,317.3 v173.92,317.3
M2-A  (via drill 0.25)
  Top 0.254: R39.P$2 C17.P$2 168.27,335.89 C51.P$2 | 168.31,335.05 C51.P$2 | C50.P$1 171.31,335.05 v171.31,334.09 | C51.P$2 168.27,335.03 v169.21,334.09 169.21,331.89 170.81,330.29 180.11,330.29 181.79,328.61 181.79,324.41 U1.22
  Bottom 0.254: v171.31,334.09 v169.21,334.09
M2-B  (via drill 0.25)
  Top 0.254: R85.P$2 C28.P$2 170.36,315.4 C55.P$2 | 170.32,316.24 C55.P$2 | C54.P$1 167.32,316.24 v167.32,317.2 | C55.P$2 170.36,316.26 v169.42,317.2 169.42,319.4 167.82,321 158.52,321 156.84,322.68 156.84,326.88 U2.22
  Bottom 0.254: v167.32,317.2 v169.42,317.2
M3-A  (via drill 0.25)
  Top 0.254: R43.P$2 C18.P$2 172.87,336.19 C50.P$2 | 172.91,335.05 C50.P$2 | C49.P$1 175.35,334.45 v175.71,334.09 | C50.P$2 172.87,334.43 v173.21,334.09 173.21,333.99 175.61,331.59 180.51,331.59 182.79,329.31 182.79,324.41 U1.20
  Bottom 0.254: v175.71,334.09 v173.21,334.09
M3-B  (via drill 0.25)
  Top 0.254: R89.P$2 C29.P$2 165.76,315.1 C54.P$2 | 165.72,316.24 C54.P$2 | C53.P$1 163.28,316.84 v162.92,317.2 | C54.P$2 165.76,316.86 v165.42,317.2 165.42,317.3 163.02,319.7 158.12,319.7 155.84,321.98 155.84,326.88 U2.20
  Bottom 0.254: v162.92,317.2 v165.42,317.2
M4-A  (via drill 0.25)
  Top 0.254: R23.P$2 C13.P$2 176.87,335.79 C49.P$2 176.91,335.05 176.91,334.59 177.41,334.09 v177.81,334.09 179.11,332.79 180.91,332.79 183.79,329.91 183.79,324.41 U1.18 | C48.P$1 179.85,334.45 v180.21,334.09
  Bottom 0.254: v180.21,334.09 v177.81,334.09
M4-B  (via drill 0.25)
  Top 0.254: R69.P$2 C24.P$2 161.76,315.5 C53.P$2 161.72,316.24 161.72,316.7 161.22,317.2 v160.82,317.2 159.52,318.5 157.72,318.5 154.84,321.38 154.84,326.88 U2.18 | C42.P$1 158.78,316.84 v158.42,317.2
  Bottom 0.254: v158.42,317.2 v160.82,317.2
M5-A  (via drill 0.25)
  Top 0.254: R27.P$2 C14.P$2 181.37,335.69 C48.P$2 | 184.81,324.42 U1.16 184.79,324.41 184.79,330.71 | 181.41,335.05 C48.P$2 | 184.79,330.71 185.27,331.19 185.51,331.19 185.79,330.91 185.79,324.41 U1.14 | C47.P$1 184.15,334.23 v184.01,334.09 | C48.P$2 182.37,334.09 v182.41,334.09 182.41,333.49 184.79,331.11 184.79,330.71
  Bottom 0.254: v184.01,334.09 v182.41,334.09
M5-B  (via drill 0.25)
  Top 0.254: R73.P$2 C25.P$2 157.26,315.6 C42.P$2 | 153.82,326.87 U2.16 153.84,326.88 153.84,320.58 | 157.22,316.24 C42.P$2 | 153.84,320.58 153.36,320.1 153.12,320.1 152.84,320.38 152.84,326.88 U2.14 | C39.P$1 154.48,317.06 v154.62,317.2 | C42.P$2 156.26,317.2 v156.22,317.2 156.22,317.8 153.84,320.18 153.84,320.58
  Bottom 0.254: v154.62,317.2 v156.22,317.2
M6-A  (via drill 0.25)
  Top 0.254: R47.P$2 C19.P$2 185.67,335.89 C47.P$2 | C47.P$2 186.79,334.07 186.79,324.41 U1.12 | C46.P$1 188.65,334.13 v188.61,334.09 | v185.61,334.09 185.61,335.13 C47.P$2
  Bottom 0.254: v188.61,334.09 v185.61,334.09
M6-B  (via drill 0.25)
  Top 0.254: R93.P$2 C30.P$2 152.96,315.4 C39.P$2 | C39.P$2 151.84,317.22 151.84,326.88 U2.12 | C38.P$1 149.98,317.16 v150.02,317.2 | v153.02,317.2 153.02,316.16 C39.P$2
  Bottom 0.254: v150.02,317.2 v153.02,317.2
M7-A  (via drill 0.25)
  Top 0.254: R31.P$2 C15.P$2 190.17,335.89 C46.P$2 | C46.P$2 190.21,335.15 190.21,330.59 187.79,328.17 187.79,324.41 U1.10 | C45.P$1 192.95,334.55 v193.31,334.19 | v191.31,334.19 191.17,334.19 C46.P$2
  Bottom 0.254: v193.31,334.19 v191.31,334.19
M7-B  (via drill 0.25)
  Top 0.254: R77.P$2 C26.P$2 148.46,315.4 C38.P$2 | C38.P$2 148.42,316.14 148.42,320.7 150.84,323.12 150.84,326.88 U2.10 | C37.P$1 145.68,316.74 v145.32,317.1 | v147.32,317.1 147.46,317.1 C38.P$2
  Bottom 0.254: v145.32,317.1 v147.32,317.1
M8-A  (via drill 0.25)
  Top 0.254: R35.P$2 C16.P$2 194.47,335.99 C45.P$2 | C45.P$2 194.51,335.15 194.51,332.49 188.79,326.77 188.79,324.41 U1.8 | v195.81,334.19 195.47,334.19 C45.P$2 | C43.P$1 197.65,334.23 v197.61,334.19
  Bottom 0.254: v197.61,334.19 v195.81,334.19
M8-B  (via drill 0.25)
  Top 0.254: R81.P$2 C27.P$2 144.16,315.3 C37.P$2 | C37.P$2 144.12,316.14 144.12,318.8 149.84,324.52 149.84,326.88 U2.8 | v142.82,317.1 143.16,317.1 C37.P$2 | C35.P$1 140.98,317.06 v141.02,317.1
  Bottom 0.254: v141.02,317.1 v142.82,317.1
M9-A  (via drill 0.25)
  Top 0.254: R19.P$2 C12.P$2 199.11,335.25 C43.P$2 | C43.P$2 199.21,335.15 199.21,331.39 198.21,330.39 193.91,330.39 189.79,326.27 189.79,324.41 U1.6 | v198.51,334.19 198.51,334.53 C43.P$2 | C44.P$1 202.02,335.2 v201.01,334.19
  Bottom 0.254: v201.01,334.19 v198.51,334.19
M9-B  (via drill 0.25)
  Top 0.254: R61.P$2 C6.P$2 139.52,316.04 C35.P$2 | C35.P$2 139.42,316.14 139.42,319.9 140.42,320.9 144.72,320.9 148.84,325.02 148.84,326.88 U2.6 | v140.12,317.1 140.12,316.76 C35.P$2 | C36.P$1 136.61,316.09 v137.62,317.1
  Bottom 0.254: v137.62,317.1 v140.12,317.1
M10-A
  Top 0.254: R51.P$2 203.69,336.33 C20.P$2 203.54,336.14 C44.P$2 203.51,335.2 203.51,332.09 200.21,328.79 195.11,328.79 191.81,325.49 | 191.79,324.41 U1.2 191.81,325.49 | U1.4 190.79,324.41 190.79,325.57 191.01,325.79 191.51,325.79 191.81,325.49
M10-B
  Top 0.254: R65.P$2 134.94,314.96 C7.P$2 135.09,315.15 C36.P$2 135.12,316.09 135.12,319.2 138.42,322.5 143.52,322.5 146.82,325.8 | 146.84,326.88 U2.2 146.82,325.8 | U2.4 147.84,326.88 147.84,325.72 147.62,325.5 147.12,325.5 146.82,325.8
N$1
  Top 0.254: U2.1 146.34,326.88 146.34,326.32 144.92,324.9 R7.P$2
  Top 0.61: C5.P$1 142.42,325.34 R7.P$2
N$2
  Top 0.254: C9.P$2 186.01,315.59 185.81,315.79 U1.35
N$3
  Top 0.254: U1.34 185.31,316.09 184.91,315.69 C8.P$2
N$6  (via drill 4 pad 6)
  other vias: 140.67,366
N$11
  Top 0.254: Q14.1 149.91,330.89 151.32,332.3 U2.38
N$12
  Top 0.61: Q14.2 Q14.4 136.02,327.86 R9.P$2 136.86,328.6 C4.P$1
N$13  (via drill 4 pad 6)
  other vias: 198.42,282.63
N$15
  Top 0.254: U2.35 152.82,335.5 152.52,335.8 152.52,335.94 C2.P$2
N$16
  Top 0.254: U2.34 153.32,335.2 153.52,335.4 C1.P$2
N$17  (via drill 0.25)
  Top 0.254: R103.P$2 v142.8,339.69 142.6,339.89 R6.P$1 | C33.P$2 144.11,341.22 v144.11,340.39
  Bottom 0.254: v144.11,340.39 144.11,340.29 143.61,339.79 142.9,339.79 v142.8,339.69
N$18
  Top 0.254: R10.P$1 197.21,312.79 | 197.21,312.79 R17.P$2 | C40.P$2 194.16,309.94 195.11,310.89 196.21,310.89 197.01,311.69 197.01,312.59 197.21,312.79
N$19
  Top 0.254: 147.02,340 146.92,339.9 | R104.P$1 R105.P$2 147.35,339.89 147.13,339.89 147.02,340 | C34.P$2 147.01,340.01 147.02,340
N$20
  Top 0.254: R59.P$2 191.71,311.29 | 191.71,311.29 R18.P$1 | C41.P$2 191.61,311.19 191.71,311.29
N$21  (via drill 0.25)
  Top 0.254: D1.P$1 Q15.3 140.92,309.6 v141.72,309.6
  Bottom 0.254: R63.2 140.62,311.5 141.82,310.3 141.82,309.7 v141.72,309.6
N$22
  Top 0.254: D1.P$2 R64.P$2
N$23
  Top 0.254: R62.P$1 141.57,313.19 Q15.1
N$25  (via drill 0.25)
  Top 0.254: D12.P$1 136.32,308.93 Q16.3 136.72,309.6 v137.42,309.6
  Bottom 0.254: v137.42,309.6 137.52,309.7 137.52,310.4 136.52,311.4 R67.2
N$32
  Top 0.254: D12.P$2 R68.P$2
N$36
  Top 0.254: Q1.1 188.72,320.4 187.31,318.99 U1.38
N$49
  Top 0.61: Q1.2 Q1.4 202.61,323.44 R13.P$2 201.77,322.69 C22.P$1
N$63
  Top 0.254: R66.P$1 137.27,313.33 Q16.1
N$64  (via drill 0.25)
  Top 0.254: D13.P$1 Q17.3 163.12,309.6 v163.62,309.6
  Bottom 0.254: R71.2 162.62,311.3 163.62,310.3 v163.62,309.6
N$65
  Top 0.254: D13.P$2 R72.P$2
N$66
  Top 0.254: U1.1 192.29,324.41 192.29,324.97 193.71,326.39 R11.P$2
  Top 0.61: C23.P$1 196.21,325.95 R11.P$2
N$67
  Top 0.254: R70.P$1 163.57,313.09 Q17.1
N$68  (via drill 0.25)
  Top 0.254: D14.P$1 Q18.3 158.52,309.8 v159.22,309.8
  Bottom 0.254: R75.2 158.22,311.4 159.22,310.4 v159.22,309.8
N$69
  Top 0.254: D14.P$2 R76.P$2
N$70  (via drill 0.25)
  Top 0.254: D2.P$1 Q3.3 197.71,341.69 v196.91,341.69
  Bottom 0.254: R21.2 198.01,339.79 196.81,340.99 196.81,341.59 v196.91,341.69
N$71
  Top 0.254: D2.P$2 R22.P$2
N$72
  Top 0.254: R20.P$1 197.06,338.1 Q3.1
N$73
  Top 0.254: R74.P$1 159.17,313.39 Q18.1
N$74  (via drill 0.25)
  Top 0.254: D15.P$1 Q19.3 149.72,309.8 v150.42,309.8
  Bottom 0.254: R79.2 149.42,311.4 150.42,310.4 v150.42,309.8
N$75  (via drill 0.25)
  Top 0.254: D3.P$1 Q4.3 175.51,341.69 v175.01,341.69
  Bottom 0.254: R25.2 176.01,339.99 175.01,340.99 v175.01,341.69
N$76
  Top 0.254: D3.P$2 R26.P$2
N$77
  Top 0.254: R24.P$1 175.06,338.2 Q4.1
N$78
  Top 0.254: D15.P$2 R80.P$2
N$79
  Top 0.254: R78.P$1 150.37,313.19 Q19.1
N$80  (via drill 0.25)
  Top 0.254: D4.P$1 Q5.3 180.11,341.49 v179.41,341.49
  Bottom 0.254: R29.2 180.41,339.89 179.41,340.89 v179.41,341.49
N$81
  Top 0.254: D4.P$2 R30.P$2
N$82
  Top 0.254: R28.P$1 179.46,337.9 Q5.1
N$83  (via drill 0.25)
  Top 0.254: D16.P$1 Q20.3 145.42,309.6 v146.02,309.6
  Bottom 0.254: R83.2 145.02,311.1 145.92,310.2 145.92,309.7 v146.02,309.6
N$84
  Top 0.254: D16.P$2 R84.P$2
N$211
  Top 0.254: R82.P$1 145.97,313.19 Q20.1
N$212  (via drill 0.25)
  Top 0.254: D5.P$1 Q6.3 188.91,341.49 v188.21,341.49
  Bottom 0.254: R33.2 189.21,339.89 188.21,340.89 v188.21,341.49
N$213
  Top 0.254: D5.P$2 R34.P$2
N$214
  Top 0.254: R32.P$1 188.26,338.1 Q6.1
N$215  (via drill 0.25)
  Top 0.254: D17.P$1 Q21.3 171.72,309.8 v172.42,309.8
  Bottom 0.254: R87.2 171.42,311.4 172.42,310.4 v172.42,309.8
N$216
  Top 0.254: D17.P$2 R88.P$2
N$217  (via drill 0.25)
  Top 0.254: D6.P$1 Q7.3 193.21,341.69 v192.61,341.69
  Bottom 0.254: R37.2 193.61,340.19 192.71,341.09 192.71,341.59 v192.61,341.69
N$218
  Top 0.254: D6.P$2 R38.P$2
N$219
  Top 0.254: R36.P$1 192.66,338.1 Q7.1
N$220
  Top 0.254: R86.P$1 172.37,313.39 Q21.1
N$221  (via drill 0.25)
  Top 0.254: D18.P$1 Q22.3 167.62,309.5 v168.02,309.5
  Bottom 0.254: R91.2 167.02,311.2 168.02,310.2 v168.02,309.5
N$222
  Top 0.254: D18.P$2 R92.P$2
N$223  (via drill 0.25)
  Top 0.254: D7.P$1 Q8.3 166.91,341.49 v166.21,341.49
  Bottom 0.254: R41.2 167.21,339.89 166.21,340.89 v166.21,341.49
N$224
  Top 0.254: D7.P$2 R42.P$2
N$225
  Top 0.254: R40.P$1 166.26,337.9 Q8.1
N$226
  Top 0.254: R90.P$1 167.97,313.29 Q22.1
N$227  (via drill 0.25)
  Top 0.254: D19.P$1 Q23.3 154.22,309.7 v154.82,309.7
  Bottom 0.254: R95.2 153.82,311.3 154.82,310.3 v154.82,309.7
N$228  (via drill 0.25)
  Top 0.254: D8.P$1 Q9.3 171.01,341.79 v170.61,341.79
  Bottom 0.254: R45.2 171.61,340.09 170.61,341.09 v170.61,341.79
N$229
  Top 0.254: D8.P$2 R46.P$2
N$230
  Top 0.254: R44.P$1 170.66,338 Q9.1
N$231
  Top 0.254: D19.P$2 R96.P$2
N$232
  Top 0.254: Q23.1 154.77,313.29 R94.P$1
N$233  (via drill 0.25)
  Top 0.254: D20.P$1 Q24.3 176.32,309.6 v176.82,309.6
  Bottom 0.254: R99.2 176.82,310.5 v176.82,309.6
N$234
  Top 0.254: D20.P$2 R100.P$2
N$235
  Top 0.254: R98.P$1 176.77,313.19 Q24.1
N$236  (via drill 0.25)
  Top 0.254: D10.P$1 202.31,342.37 Q11.3 201.91,341.69 v201.21,341.69
  Bottom 0.254: v201.21,341.69 201.11,341.59 201.11,340.89 202.11,339.89 R53.2
N$237
  Top 0.254: D10.P$2 R54.P$2
N$238
  Top 0.254: R52.P$1 201.36,337.95 Q11.1
N$239  (via drill 0.25)
  Top 0.254: D9.P$1 Q10.3 184.41,341.59 v183.81,341.59
  Bottom 0.254: R49.2 184.81,339.99 183.81,340.99 v183.81,341.59
N$240
  Top 0.254: D9.P$2 R50.P$2
N$241
  Top 0.254: Q10.1 183.86,338 R48.P$1
N$245  (via drill 0.25)
  Top 0.254: D11.P$1 Q12.3 162.31,341.69 v161.81,341.69
  Bottom 0.254: R57.2 161.81,340.79 v161.81,341.69
N$246
  Top 0.254: D11.P$2 R58.P$2
N$247
  Top 0.254: R56.P$1 161.86,338.1 Q12.1
N$413  (via drill 4 pad 6)
  other vias: 9.86,90.41
N$414  (via drill 4 pad 6)
  other vias: 67.61,7.04
S1-A
  Top 0.254: R56.P$2 161.11,335.83 161.11,329.29 162.41,327.99 178.11,327.99 180.31,325.79 180.31,323.49 180.79,323.01 180.79,317.01 U1.25
S1-B
  Top 0.254: R98.P$2 177.52,315.46 177.51,315.47 177.51,317.69 175.71,319.49 175.71,320.69 173.1,323.3 159.8,323.3 158.41,324.69 158.41,327.59 157.84,328.16 157.84,334.28 U2.25
S2-A
  Top 0.254: R40.P$2 165.71,335.83 165.71,330.79 166.91,329.59 179.81,329.59 181.29,328.11 181.29,324.41 U1.23
S2-B
  Top 0.254: R86.P$2 172.92,315.46 172.92,320.5 171.72,321.7 158.82,321.7 157.34,323.18 157.34,326.88 U2.23
S3-A
  Top 0.254: R44.P$2 170.41,333.69 173.11,330.99 180.31,330.99 182.29,329.01 182.29,324.41 U1.21
S3-B
  Top 0.254: R90.P$2 168.22,317.6 165.52,320.3 158.32,320.3 156.34,322.28 156.34,326.88 U2.21
S4-A
  Top 0.254: R24.P$2 174.31,335.93 174.31,333.99 176.11,332.19 180.71,332.19 183.29,329.61 183.29,324.41 U1.19
S4-B
  Top 0.254: R70.P$2 164.32,315.36 164.32,317.3 162.52,319.1 157.92,319.1 155.34,321.68 155.34,326.88 U2.19
S5-A
  Top 0.254: R28.P$2 178.91,335.83 178.91,334.29 179.81,333.39 181.11,333.39 184.29,330.21 184.29,324.41 U1.17
S5-B
  Top 0.254: R74.P$2 159.72,315.46 159.72,317 158.82,317.9 157.52,317.9 154.34,321.08 154.34,326.88 U2.17
S6-A
  Top 0.254: R48.P$2 183.51,336.23 183.11,335.83 183.11,333.69 183.91,332.89 185.61,332.89 186.29,332.21 186.29,324.41 U1.13
S6-B
  Top 0.254: R94.P$2 155.12,315.06 155.52,315.46 155.52,317.6 154.72,318.4 153.02,318.4 152.34,319.08 152.34,326.88 U2.13
S7-A
  Top 0.254: R32.P$2 187.29,335.61 187.29,324.41 U1.11
S7-B
  Top 0.254: R78.P$2 151.34,315.68 151.34,326.88 U2.11
S8-A
  Top 0.254: R36.P$2 192.21,336.13 192.21,331.19 188.29,327.27 188.29,324.41 U1.9
S8-B
  Top 0.254: R82.P$2 146.42,315.16 146.42,320.1 150.34,324.02 150.34,326.88 U2.9
S9-A
  Top 0.254: R20.P$2 196.81,331.39 196.41,330.99 193.81,330.99 189.29,326.47 189.29,324.41 U1.7
S9-B
  Top 0.254: R62.P$2 141.82,319.9 142.22,320.3 144.82,320.3 149.34,324.82 149.34,326.88 U2.7
S10-A
  Top 0.254: R52.P$2 200.21,335.29 200.21,330.49 199.51,329.79 194.01,329.79 190.31,326.09 U1.5
S10-B
  Top 0.254: R66.P$2 138.42,316 138.42,320.8 139.12,321.5 144.62,321.5 148.32,325.2 U2.5
SWTEN-A
  Top 0.254: SJ1.2 186.32,311.89 186.61,312.18 186.61,312.89 186.81,313.09 186.81,315.59 186.31,316.09 U1.36
SWTEN-B
  Top 0.254: U2.36 152.31,335.09 152.01,335.39 151.81,335.39 151.52,335.68 151.52,338.1 152,338.58 152,339.69 SJ2.2
T1-A
  Top 0.254: U1.27 181.81,307.69 182.41,307.09 182.41,302.49 180.81,300.89 180.81,297.83 R5.P$1 182.51,296.13 CNR6.5
T1-B
  Top 0.254: CNR8.5 155.62,353.7 R110.P$1 155.52,352.76 154.91,352.15 154.91,349.49 154.31,348.89 154.31,347.49 154.92,346.88 154.92,343.08 156.21,341.79 156.21,337.09 156.81,336.49 U2.27
T2-A
  Top 0.254: CNR6.4 184.51,295.53 R4.P$1 182.21,297.83 182.21,300.89 183.01,301.69 183.01,307.49 182.31,308.19 U1.28
T2-B
  Top 0.254: CNR8.4 154.22,353.1 R109.P$1 153.41,351.95 153.41,343.89 155.71,341.59 155.71,336.99 156.32,336.38 U2.28
T3-A
  Top 0.254: U1.29 182.81,308.79 183.81,307.79 183.81,297.83 R3.P$1 184.51,296.39 186.51,294.39 CNR6.3
T3-B
  Top 0.254: R108.P$1 152.23,352.37 151.92,352.06 151.91,352.05 151.91,344.79 155.31,341.39 155.31,336.69 155.82,336.18 U2.29 | R108.P$1 152.62,352.9 | R108.P$1 152.62,353.38 151.51,354.49 150.83,354.49 CNR8.3
T4-A
  Top 0.254: U1.32 184.31,316.29 183.81,315.79 183.81,313.79 183.31,313.29 183.31,309.09 185.21,307.19 185.21,297.83 R2.P$1 186.01,297.03 186.01,296.39 CNR6.2
T4-B
  Top 0.254: U2.32 154.32,335 154.82,335.5 154.82,337.5 154.91,337.59 154.91,340.69 154.21,341.39 152.41,341.39 150.51,343.29 150.51,352.29 150.98,352.76 R107.P$1 151.22,353.18 150.21,354.19 149.13,354.19 CNR8.2
T5-A
  Top 0.254: U1.33 184.81,316.19 184.21,315.59 184.21,313.09 183.81,312.69 183.81,309.39 186.61,306.59 186.61,297.83 R1.P$1 190.51,293.93 CNR6.1
T5-B
  Top 0.254: U2.33 153.82,335.1 154.42,335.7 154.42,338.2 154.51,338.29 154.51,340.49 154.11,340.89 152.21,340.89 149.91,343.19 149.91,347.59 148.61,348.89 148.61,351.55 R106.P$1 | R106.P$1 148.56,352.76 CNR8.1 | R106.P$1 150.14,352.76
WDT-A
  Top 0.254: R16.P$1 188.57,313.09 188.01,313.09 187.79,313.31 187.79,316.97 U1.39
WDT-B
  Top 0.254: R102.P$1 150.06,338.2 150.62,338.2 150.84,337.98 150.84,334.32 U2.39

## Text on the board
tPlace: CELL-A | TEMPERATURE-B | www.teamojas.com | www.teamojas.com | v10.0 | Board No. | TEMPERATURE-A | CELL-B | C:/Users/user pc/Downloads/TE_new_logo.bmp | 1 | 3 | 5 | 7 | 9 | NC | 1 | 3 | 5 | 7 | 9 | NC | 12 | 7 | 6 | 8 | 1 | 6 | 0 | 2 | 4 | 6 | 8 | 10 | 0 | 2 | 4 | 10 | www.teamojas.com | v10.0 | Board No. | IM | IM | M-SIDE | IP | S-SIDE | IP | #RR | C:/Users/user pc/Downloads/TE_new_logo.bmp
bPlace: WARNING / HIGH VOLTAGE | 0 | 2 | 4 | WARNING / HIGH VOLTAGE | www.teamojas.com